# Altium schematic sheet 2017_LEVI.SchDoc
size A
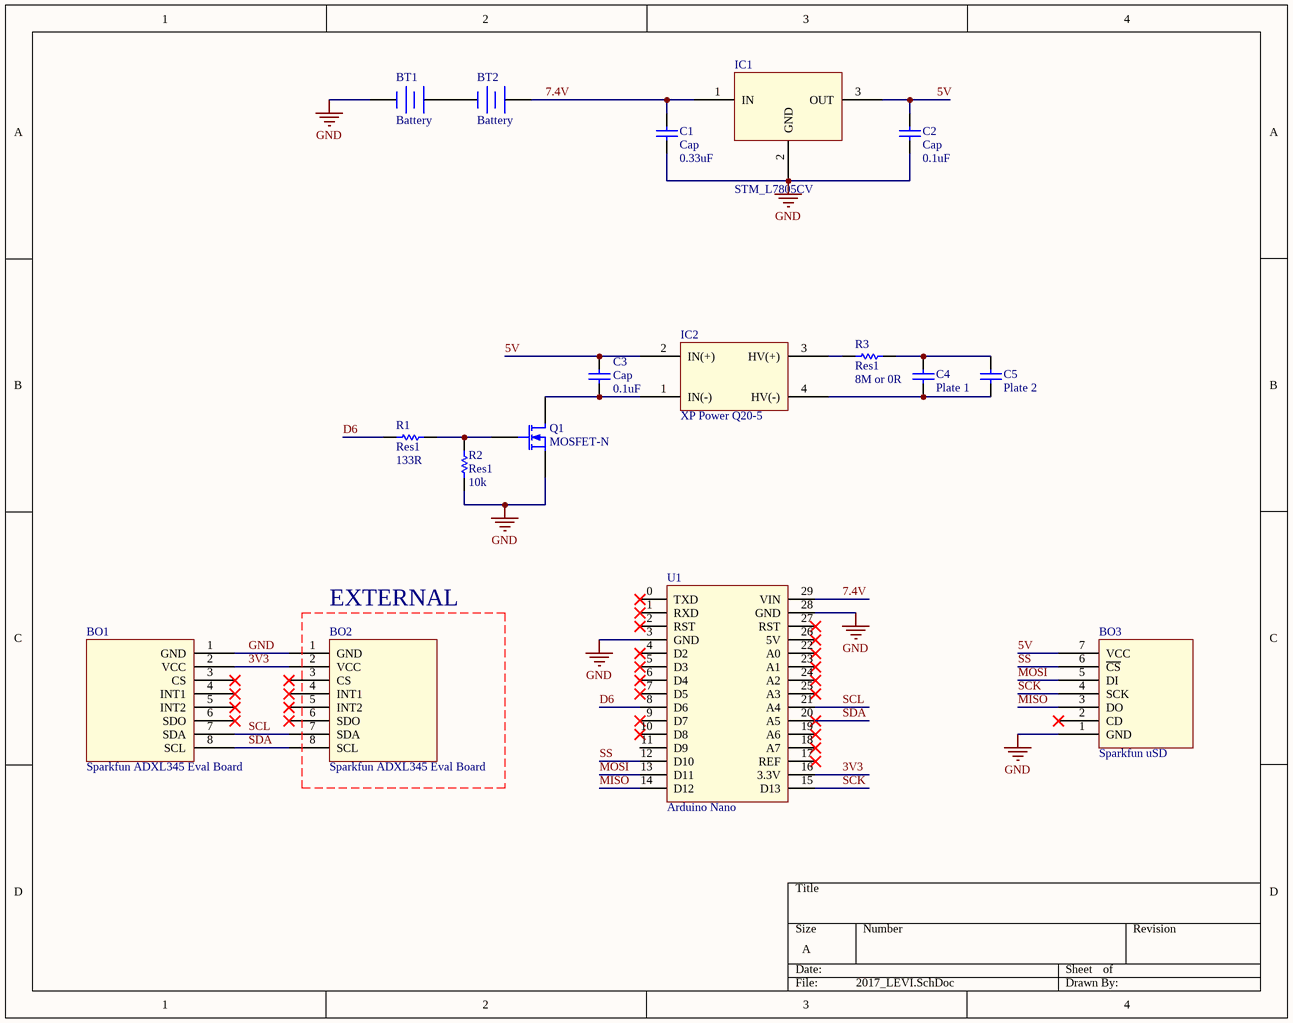
[diagram p0: 2017_LEVI.SchDoc]

## Parts
BO1  Sparkfun ADXL345 Eval Board  [Sparkfun ADXL345 Breakout]
BO2  Sparkfun ADXL345 Eval Board  [Sparkfun ADXL345 Breakout]
BO3  Sparkfun uSD  [Sparkfun MicroSD Breakout]
BT1  Battery  [BAT-2]
BT2  Battery  [BAT-2]
C1  Cap  value 0.33uF  [RAD-0.3]
C2  Cap  value 0.1uF  [RAD-0.3]
C3  Cap  value 0.1uF  [RAD-0.3]
C4  Plate 1  [RAD-0.3]
C5  Plate 2  [RAD-0.3]
IC1  STM_L7805CV
IC2  XP Power Q20-5
Q1  MOSFET-N  [E3]
R1  Res1  value 133R  [AXIAL-0.3]
R2  Res1  value 10k  [AXIAL-0.3]
R3  Res1  value 8M or 0R  [AXIAL-0.3]
U1  Arduino Nano  [Arduino Nano]

## Nets
GND: BO1.1(GND) BO2.1(GND) BO3.1(GND) BT1.2(-) C1.1 C2.1 IC1.2(GND) Q1.3(S) R2.1 U1.3(GND) U1.28(GND)
3V3: BO1.2(VCC) BO2.2(VCC) U1.16(3.3V)
5V: BO3.7(VCC) C2.2 C3.2 IC1.3(OUT) IC2.2(IN(+))
7.4V: BT2.1(+) C1.2 IC1.1(IN) U1.29(VIN)
D6: R1.1 U1.8(D6)
MISO: BO3.3(DO) U1.14(D12)
MOSI: BO3.5(DI) U1.13(D11)
SCK: BO3.4(SCK) U1.15(D13)
SCL: BO1.7(SDA) BO2.7(SDA) U1.21(A4)
SDA: BO1.8(SCL) BO2.8(SCL) U1.20(A5)
SS: BO3.6(~{CS}) U1.12(D10)
NetBT1_1: BT1.1(+) BT2.2(-)
NetC3_1: C3.1 IC2.1(IN(-)) Q1.2(D)
NetC4_1: C4.1 C5.1 IC2.4(HV(-))
NetC4_2: C4.2 C5.2 R3.2
NetIC2_3: IC2.3(HV(+)) R3.1
NetQ1_1: Q1.1(G) R1.2 R2.2

Not connected (* = marked no-connect by the designer): BO1 3(CS)* 4(INT1)* 5(INT2)* 6(SDO)*; BO2 3(CS)* 4(INT1)* 5(INT2)* 6(SDO)*; BO3 2(CD)*; U1 0(TXD)* 1(RXD)* 2(RST)* 4(D2)* 5(D3)* 6(D4)* 7(D5)* 9(D7)* 10(D8)* 11(D9) 17(REF)* 18(A7)* 19(A6)* 22(A0)* 23(A1)* 24(A2)* 25(A3)* 26(5V)* 27(RST)*

## Notes on the sheet
- (near BO2) EXTERNAL

## Library data of the parts
BT1 BT2 = Battery: Multicell Battery; Published: 24-Mar-1999; LatestRevisionDate: 17-Jul-2002; LatestRevisionNote: Re-released for DXP Platform.; PackageReference: BAT-2; Publisher: Altium Limited; PackageDescription: Battery; 2 Leads
C1-C5 = Cap: Capacitor; Published: 8-Jun-2000; LatestRevisionDate: 17-Jul-2002; LatestRevisionNote: Re-released for DXP Platform.; PackageReference: RAD-0.3; Publisher: Altium Limited; PackageDescription: Radial Cap, Thru-Hole; 2 Leads; 0.3 in Pin Spacing
Q1 = MOSFET-N: N-Channel MOSFET; Published: 8-Jun-2000; LatestRevisionDate: 17-Jul-2002; LatestRevisionNote: Re-released for DXP Platform.; PackageVersion: 1995/1996; PackageReference: E3; Publisher: Altium Limited; PackageDescription: TO, Flat Index; 3 In-Line, Axial Leads; Body Dia. 4.6mm; Lead Dia. 0.5 mm (max)
R1-R3 = Res1: Resistor; Published: 8-Jun-2000; LatestRevisionDate: 17-Jul-2002; LatestRevisionNote: Re-released for DXP Platform.; PackageReference: AXIAL-0.3; Publisher: Altium Limited; PackageDescription: Axial Device, Thru-Hole; 2 Leads; 0.3 in Pin Spacing